# Altium schematic sheet RPL_POWER_5V.SchDoc: Step-Down Switching Regulater +12VDC to +5VDC
size A; Date: Dec 17, 2017; DrawnBy: Seyed Omid Hasanli; Revision: 1.0; SheetNumber: 3
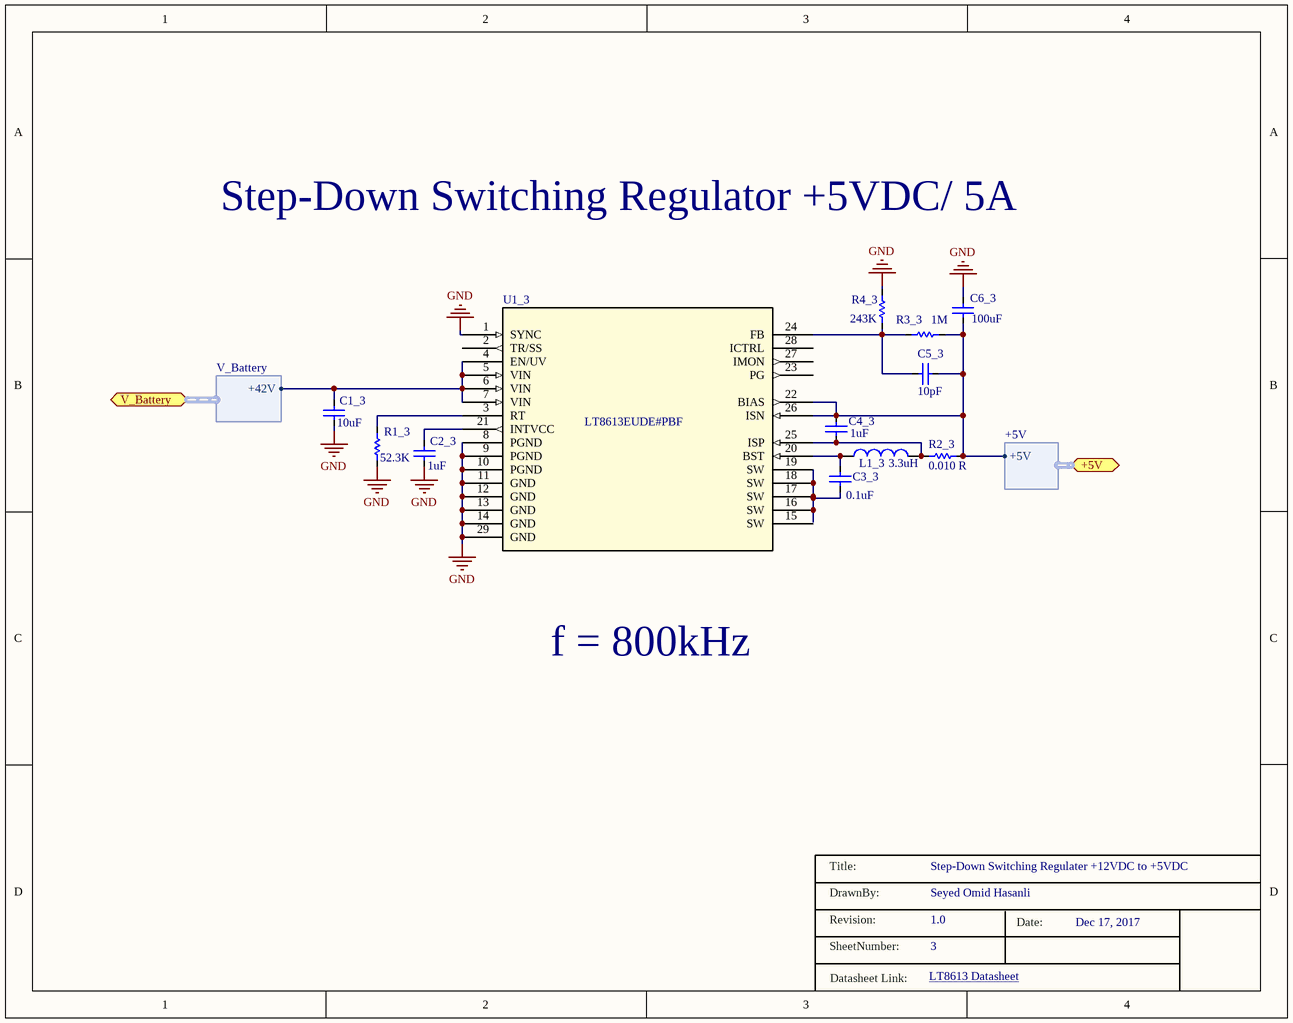
[diagram p0: RPL_POWER_5V.SchDoc]

## Parts
C1_3  value 10uF  [C0805C475K9RACAUTO]  (hidden comment: Cap)
C2_3  value 1uF  [C0805C475K9RACAUTO]  (hidden comment: Cap)
C3_3  value 0.1uF  [C0805C475K9RACAUTO]  (hidden comment: Cap)
C4_3  value 1uF  [C0805C475K9RACAUTO]  (hidden comment: Cap)
C5_3  value 10pF  [C0805C475K9RACAUTO]  (hidden comment: Cap)
C6_3  value 100uF  [C0805C475K9RACAUTO]  (hidden comment: Cap)
L1_3  value 3.3uH  [IHLP2525EZER3R3M01]  (hidden comment: VISHAY IHLP2525EZ-01)
R1_3  value 52.3K  [RES 0805]  (hidden comment: Res)
R2_3  value 0.010 R  [RES 1206]  (hidden comment: Res)
R3_3  value 1M  [RES 0805]  (hidden comment: Res)
R4_3  value 243K  [RES 0805]  (hidden comment: Res)
U1_3  LT8613EUDE#PBF  [QFN-28_UDE-L]

## Ports
+5V (harness +5V), V_Battery (harness V_Battery)

## Harnesses
+5V: +5V
V_Battery: +42V

## Nets
GND: C1_3.1 C2_3.1 C6_3.2 R1_3.1 R4_3.2 U1_3.1(SYNC) U1_3.8(PGND) U1_3.9(PGND) U1_3.10(PGND) U1_3.11(GND) U1_3.12(GND) U1_3.13(GND) U1_3.14(GND) U1_3.29(GND)
NetC1_3_2: C1_3.2 U1_3.4(EN/UV) U1_3.5(VIN) U1_3.6(VIN) U1_3.7(VIN) ; port V_Battery.+42V
NetC2_3_2: C2_3.2 U1_3.21(INTVCC)
NetC3_3_1: C3_3.1 U1_3.16(SW) U1_3.17(SW) U1_3.18(SW) U1_3.19(SW)
NetC3_3_2: C3_3.2 L1_3.1 U1_3.20(BST)
NetC4_3_1: C4_3.1 C5_3.1 C6_3.1 R2_3.2 R3_3.2 U1_3.22(BIAS) U1_3.26(ISN) ; port +5V.+5V
NetC4_3_2: C4_3.2 L1_3.2 R2_3.1 U1_3.25(ISP)
NetC5_3_2: C5_3.2 R3_3.1 R4_3.1 U1_3.24(FB)
NetR1_3_2: R1_3.2 U1_3.3(RT)

Not connected (* = marked no-connect by the designer): U1_3 2(TR/SS) 15(SW) 23(PG) 27(IMON) 28(ICTRL)

## Notes on the sheet
- Step-Down Switching Regulator +5VDC/ 5A
- f = 800kHz
- LT8613 Datasheet <http://cds.linear.com/docs/en/datasheet/8613f.pdf>
- Title:
- DrawnBy:
- Revision:
- SheetNumber:
- Date:
- Datasheet Link:

## Library data of the parts
L1_3 = Inductor: Link: https://www.mouser.com/ProductDetail/Vishay/IHLP2525EZER3R3M01/?qs=%2fha2pyFadug41qQurrvOks2uVKImTYqYAa9YdcqfxO0gtXwyeXUCX2QpKxCPAxQH
U1_3 = LT8613EUDE#PBF: Imported; Vendor: Linear Technology; Manufacturer_Part_Number: lt8613eude#pbf; Value: Value; Type: Type; RefDes: RefDes